# EAGLE design musIR-tiny-mk-1.0 (EAGLE 7.5.0)
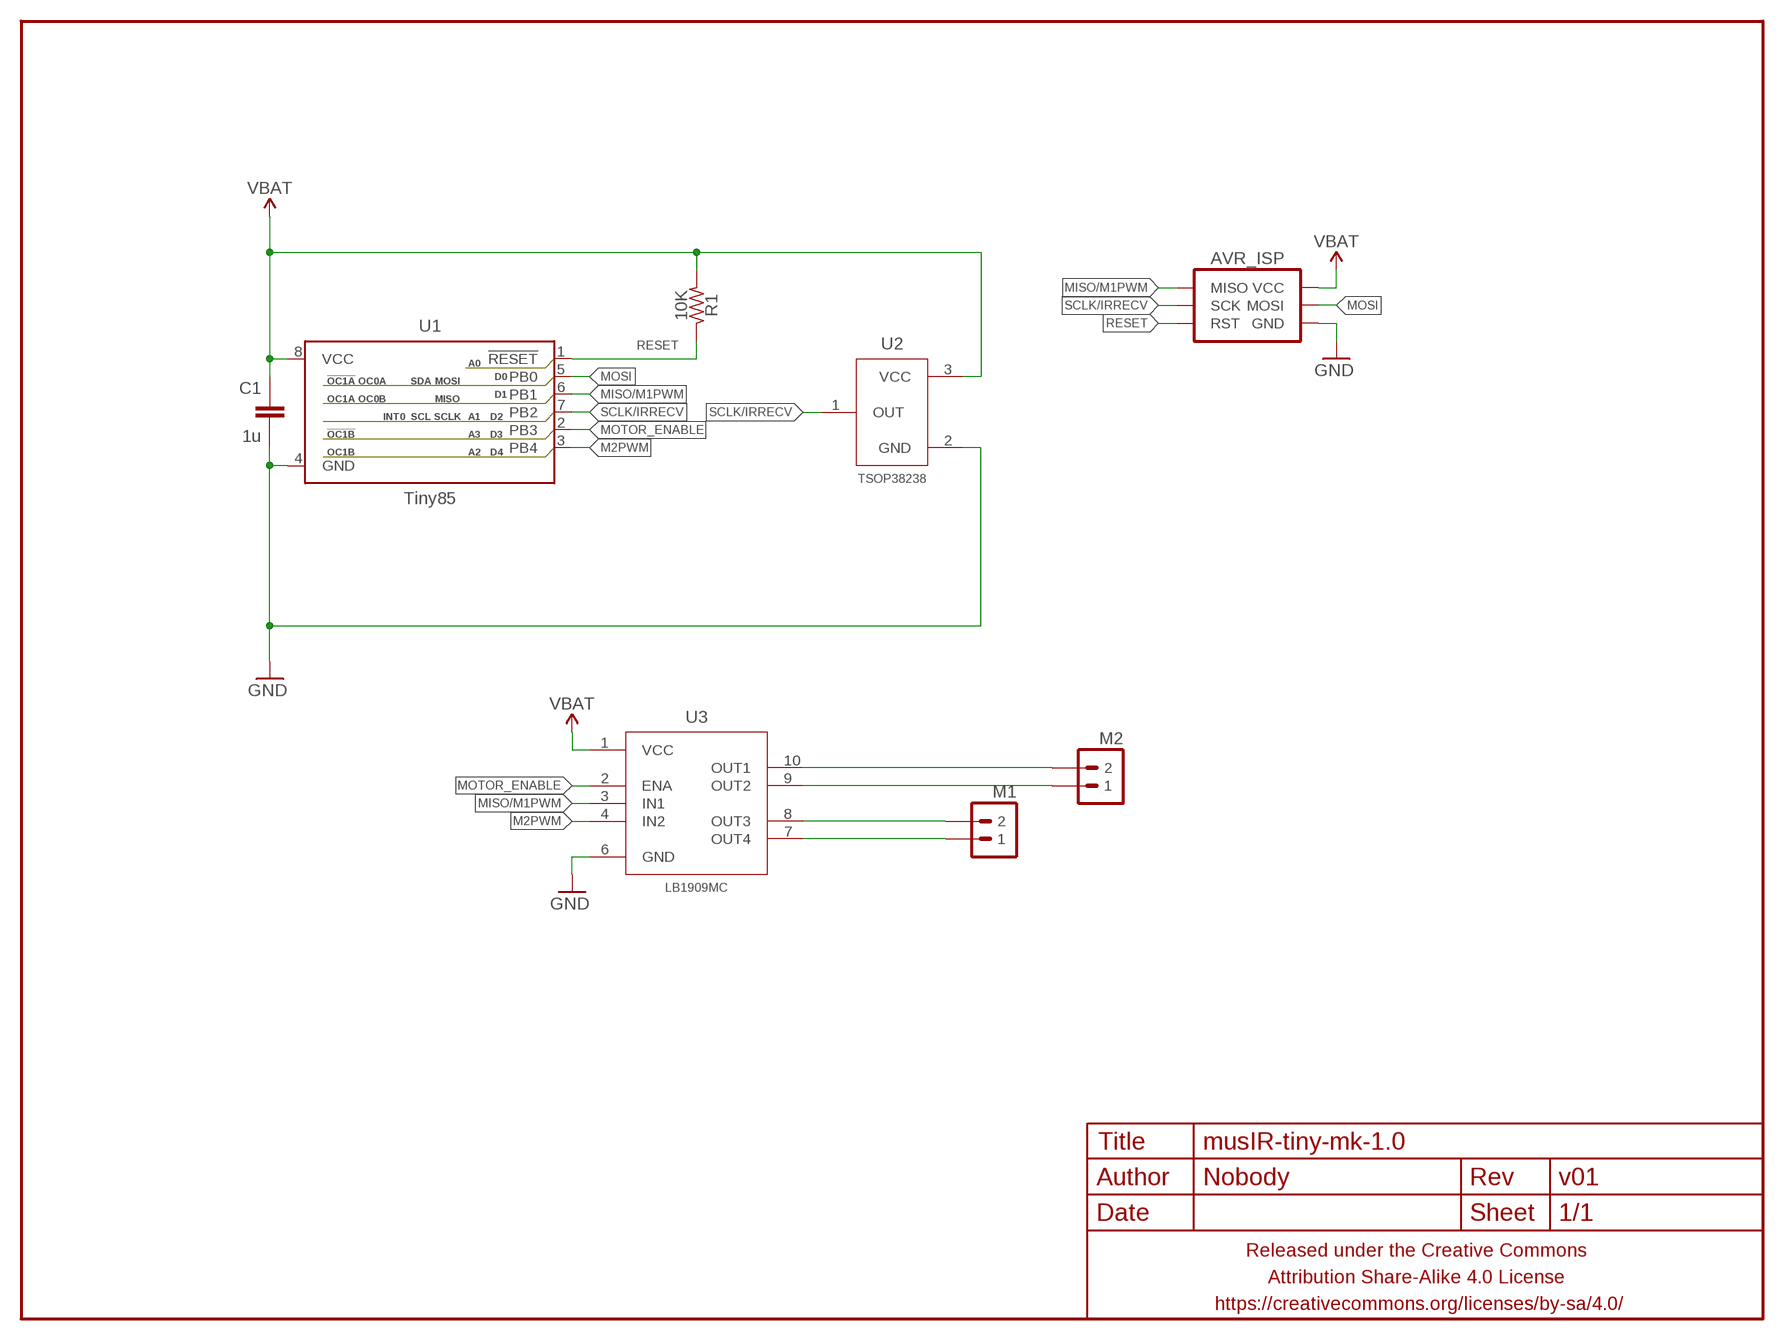
[diagram p0: schematic, sheet 1]

## Parts
AVR_ISP  AVR_SPI_PRG_6TESTPOINTS  [2X3_TEST_POINTS]
C1  1u  CAPACITOR-CERAMICC0603-TIGHTER  [C0603-TIGHTER]
FRAME1  FRAME-LETTERNO_PACKAGE  [DUMMY]
M1  M02PTH-CENTERED  [1X02-CENTER]
M2  M02PTH-CENTERED  [1X02-CENTER]
R1  10K  RESISTORR0603-TIGHTER  [R0603-TIGHTER]
U1  Tiny85  ATTINY45TINY85-20-SOICW  [SO08-EIAJ]
U2  TSOP38238  TSOP382__/4__  [TSOP38238]
U3  LB1909MC  [SO10-NOTREALLY]

## Nets
GND: AVR_ISP.6(GND) C1.2 U1.4(GND) U2.2(GND) U3.6(GND)
M2PWM: U1.3(PB4) U3.4(IN2)
MISO/M1PWM: AVR_ISP.1(MISO) U1.6(PB1) U3.3(IN1)
MOSI: AVR_ISP.4(MOSI) U1.5(PB0)
MOTOR_ENABLE: U1.2(PB3) U3.2(ENA)
N$1: M1.1 U3.7(OUT4)
N$2: M1.2 U3.8(OUT3)
N$3: M2.1 U3.9(OUT2)
N$4: M2.2 U3.10(OUT1)
RESET: AVR_ISP.5(RST) R1.1 U1.1(!RESET)
SCLK/IRRECV: AVR_ISP.3(SCK) U1.7(PB2) U2.1(OUT)
VBAT: AVR_ISP.2(VCC) C1.1 R1.2 U1.8(VCC) U2.3(VCC) U3.1(VCC)

## Library data of the parts
AVR_ISP = a_parts:AVR_SPI_PRG_6: AVR ISP 6 Pin This is the reduced ISP connector for AVR programming. Common on Arduino. This footprint will take up less PCB space and can be used with a 10-pin to 6-pin adapter such as SKU: BOB-08508 **Special note about "TEST_POINT" package. The stop mask is on the top side, so if you want your programming test points to be on the bottom of your board, make sure to place this package on the bottom side of the board. This also ensure that the orientation to program from the bottom side will be correct.
C1 = a_parts:CAPACITOR-CERAMIC: CAPACITOR, European symbol
FRAME1 = a_parts:FRAME-LETTER: Schematic Frame Standard 8.5x11 US Letter frame; DESIGNER: Nobody; VERSION: v01
M1 M2 = a_parts:M02: Standard 2-pin 0.1" header. Use with - straight break away headers ( PRT-00116) - right angle break away headers (PRT-00553) - swiss pins (PRT-00743) - machine pins (PRT-00117) - female headers (PRT-00115) Molex polarized connector foot print use with: PRT-08233 with associated crimp pins and housings. 2.54_SCREWTERM for use with PRT-10571. 3.5mm Screw Terminal footprints for PRT-08084 5mm Screw Terminal footprints for use with PRT-08433
R1 = a_parts:RESISTOR: RESISTOR, American symbol
U1 = a_parts:ATTINY45: Atmel 8-pin 2/4/8kB flash uC; PROD_ID: IC-09092; VALUE: Tiny85-20-SMT
U2 = a_parts:TSOP382__/4__
U3 = a_parts:LB1909MC

## Board
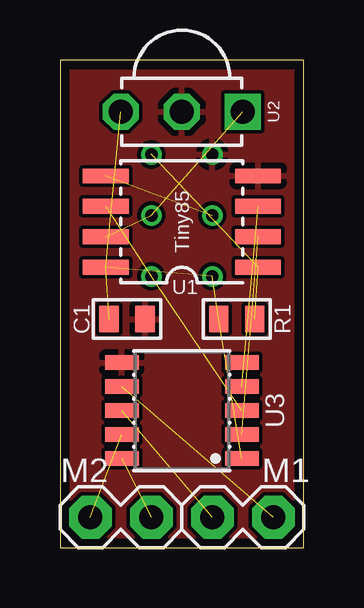
[diagram p1: board, top side]
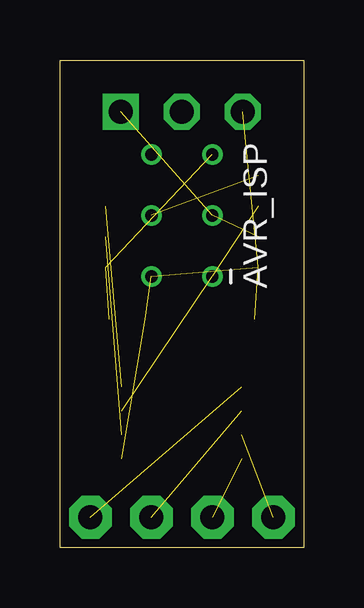
[diagram p2: board, bottom side, seen from below]

Size 10.16 x 20.32 mm. Coordinates in mm from the lower left corner, seen from the top.
Outline: 0,0 10.16,0 10.16,20.32 0,20.32 0,0
Copper layers (1*16): Top 0.0356mm / dielectric 1.5011mm / Bottom 0.0356mm
Design rules "LaenPCBOrder2": minimum track width 6mil, minimum drill 13mil, track to track 6mil, track to pad 6mil, pad to pad 6mil, via to via 6mil, smd to smd 6mil, copper to edge 15mil, drill to drill 6mil, minimum pad ring 7mil, minimum via ring 7mil, stop-mask expansion 3mil, vias tented up to drill 20mil, thermal gap 10mil

### Footprints (pad centres in the part's own frame; a part is rotated, then mirrored left to right if it is on the bottom)
2X3_TEST_POINTS = drill 0.508: 1 -2.54,-1.27; 2 -2.54,1.27; 3 0,-1.27; 4 0,1.27; 5 2.54,-1.27; 6 2.54,1.27
C0603-TIGHTER = smd 0.8 x 1.1: 1 -0.75,0; 2 0.75,0
1X02-CENTER = drill 1 pad 1.778 octagon: 1 -1.27,0; 2 1.27,0
R0603-TIGHTER = smd 0.8 x 1.1: 1 -0.75,0; 2 0.75,0
SO08-EIAJ = smd 0.61 x 1.905: 1 -1.905,-3.175; 2 -0.635,-3.175; 3 0.635,-3.175; 4 1.905,-3.175; 5 1.905,3.175; 6 0.635,3.175; 7 -0.635,3.175; 8 -1.905,3.175
TSOP38238 = drill 1 square: 1 -2.54,0 | drill 1 octagon: 2 0,0; 3 2.54,0
SO10-NOTREALLY = smd 0.6 x 1.4: 1 -2,-2.5; 2 -1,-2.5; 3 0,-2.5; 4 1,-2.5; 5 2,-2.5; 6 2,2.5; 7 1,2.5; 8 0,2.5; 9 -1,2.5; 10 -2,2.5

### Placement (x,y rotation side)
AVR_ISP  5.08,13.84 90 bottom
C1  2.79,9.53 0 top
FRAME1  0,0 0 top
M1  7.62,1.27 180 top
M2  2.54,1.27 0 top
R1  7.37,9.53 180 top
U1  5.08,13.59 90 top
U2  5.08,18.16 180 top
U3  5.08,5.71 90 top

### Tracks (layer width: path | path; a pad name or v marks a point on that pad's centre or on a via)
GND
  pour Top (rank 6): 0,0 10.16,0 10.16,20.32 0,20.32
M2PWM  (1 unrouted)
MISO/M1PWM  (2 unrouted)
MOSI  (1 unrouted)
MOTOR_ENABLE  (1 unrouted)
N$1  (1 unrouted)
N$2  (1 unrouted)
N$3  (1 unrouted)
N$4  (1 unrouted)
RESET  (2 unrouted)
SCLK/IRRECV  (2 unrouted)
VBAT  (5 unrouted)